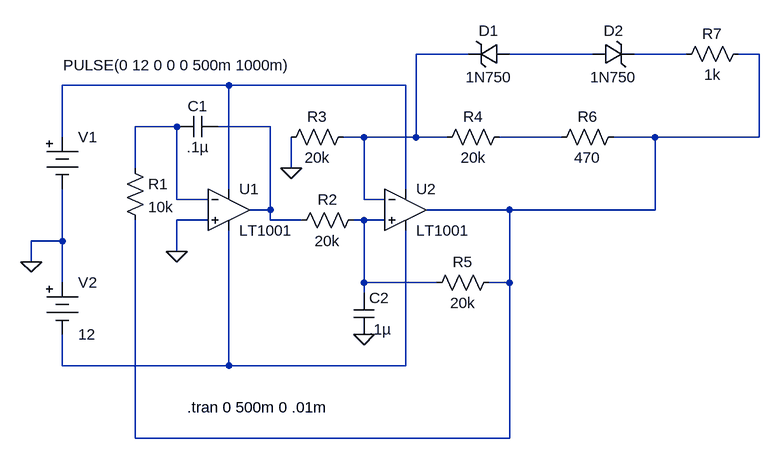
[diagram p0: schematic cuadraturax.asc]
cuadraturax.asc, the LTspice schematic file:
Version 4
SHEET 1 980 680
WIRE 528 -64 448 -64
WIRE 720 -64 592 -64
WIRE 864 -64 784 -64
WIRE 976 -64 944 -64
WIRE 160 -16 -96 -16
WIRE 432 -16 160 -16
WIRE 80 48 16 48
WIRE 224 48 144 48
WIRE -96 64 -96 -16
WIRE 368 64 336 64
WIRE 448 64 448 -64
WIRE 448 64 368 64
WIRE 496 64 448 64
WIRE 672 64 576 64
WIRE 816 64 752 64
WIRE 976 64 976 -64
WIRE 976 64 816 64
WIRE 16 112 16 48
WIRE 256 112 256 64
WIRE 160 144 160 -16
WIRE 432 144 432 -16
WIRE 80 160 80 48
WIRE 128 160 80 160
WIRE 368 160 368 64
WIRE 400 160 368 160
WIRE 224 176 224 48
WIRE 224 176 192 176
WIRE 592 176 464 176
WIRE 816 176 816 64
WIRE 816 176 592 176
WIRE 128 192 80 192
WIRE 224 192 224 176
WIRE 272 192 224 192
WIRE 368 192 352 192
WIRE 400 192 368 192
WIRE -96 224 -96 144
WIRE -96 224 -144 224
WIRE 80 240 80 192
WIRE -144 256 -144 224
WIRE -96 288 -96 224
WIRE 368 288 368 192
WIRE 480 288 368 288
WIRE 592 288 592 176
WIRE 592 288 560 288
WIRE 368 304 368 288
WIRE -96 416 -96 368
WIRE 160 416 160 208
WIRE 160 416 -96 416
WIRE 432 416 432 208
WIRE 432 416 160 416
WIRE 16 528 16 192
WIRE 592 528 592 288
WIRE 592 528 16 528
FLAG -144 256 0
FLAG 80 240 0
FLAG 256 112 0
FLAG 368 368 0
SYMBOL Opamps\\LT1001 160 112 R0
SYMATTR InstName U1
SYMBOL Opamps\\LT1001 432 112 R0
SYMATTR InstName U2
SYMBOL res 0 96 R0
SYMATTR InstName R1
SYMATTR Value 10k
SYMBOL cap 144 32 R90
WINDOW 0 0 32 VBottom 2
WINDOW 3 32 32 VTop 2
SYMATTR InstName C1
SYMATTR Value .1µ
SYMBOL Misc\\battery -96 48 R0
WINDOW 3 1 -95 Left 2
WINDOW 123 0 0 Left 2
WINDOW 39 0 0 Left 2
SYMATTR Value PULSE(0 12 0 0 0 500m 1000m)
SYMATTR InstName V1
SYMBOL Misc\\battery -96 272 R0
WINDOW 123 0 0 Left 2
WINDOW 39 0 0 Left 2
SYMATTR InstName V2
SYMATTR Value 12
SYMBOL res 368 176 R90
WINDOW 0 0 56 VBottom 2
WINDOW 3 32 56 VTop 2
SYMATTR InstName R2
SYMATTR Value 20k
SYMBOL res 352 48 R90
WINDOW 0 0 56 VBottom 2
WINDOW 3 32 56 VTop 2
SYMATTR InstName R3
SYMATTR Value 20k
SYMBOL res 592 48 R90
WINDOW 0 0 56 VBottom 2
WINDOW 3 32 56 VTop 2
SYMATTR InstName R4
SYMATTR Value 20k
SYMBOL res 576 272 R90
WINDOW 0 0 56 VBottom 2
WINDOW 3 32 56 VTop 2
SYMATTR InstName R5
SYMATTR Value 20k
SYMBOL cap 352 304 R0
SYMATTR InstName C2
SYMATTR Value .1µ
SYMBOL res 768 48 R90
WINDOW 0 0 56 VBottom 2
WINDOW 3 32 56 VTop 2
SYMATTR InstName R6
SYMATTR Value 470
SYMBOL res 960 -80 R90
WINDOW 0 0 56 VBottom 2
WINDOW 3 32 56 VTop 2
SYMATTR InstName R7
SYMATTR Value 1k
SYMBOL zener 592 -80 R90
WINDOW 0 -4 32 VBottom 2
WINDOW 3 36 32 VTop 2
SYMATTR InstName D1
SYMATTR Value 1N750
SYMBOL zener 720 -48 R270
WINDOW 0 36 32 VTop 2
WINDOW 3 -4 32 VBottom 2
SYMATTR InstName D2
SYMATTR Value 1N750
TEXT 96 480 Left 2 !.tran 0 500m 0 .01m

The netlist it stands for:
* cuadraturax.asc
XU1 0 N006 N005 N010 N007 LT1001  ; pins In+ In- V+ V- OUT
XU2 N009 N001 N005 N010 N004 LT1001  ; pins In+ In- V+ V- OUT
R1 N006 N004 10k
C1 N007 N006 .1µ
V1 N005 0 PULSE(0 12 0 0 0 500m 1000m)
V2 0 N010 12
R2 N009 N007 20k
R3 N001 0 20k
R4 N008 N001 20k
R5 N004 N009 20k
C2 N009 0 .1µ
R6 N004 N008 470
R7 N004 N003 1k
D1 N002 N001 1N750
D2 N002 N003 1N750
.model D D
.lib standard.dio
.tran 0 500m 0 .01m
.lib LTC.lib
.backanno
.end